# Altium project Kontrollerkort.PrjPcb
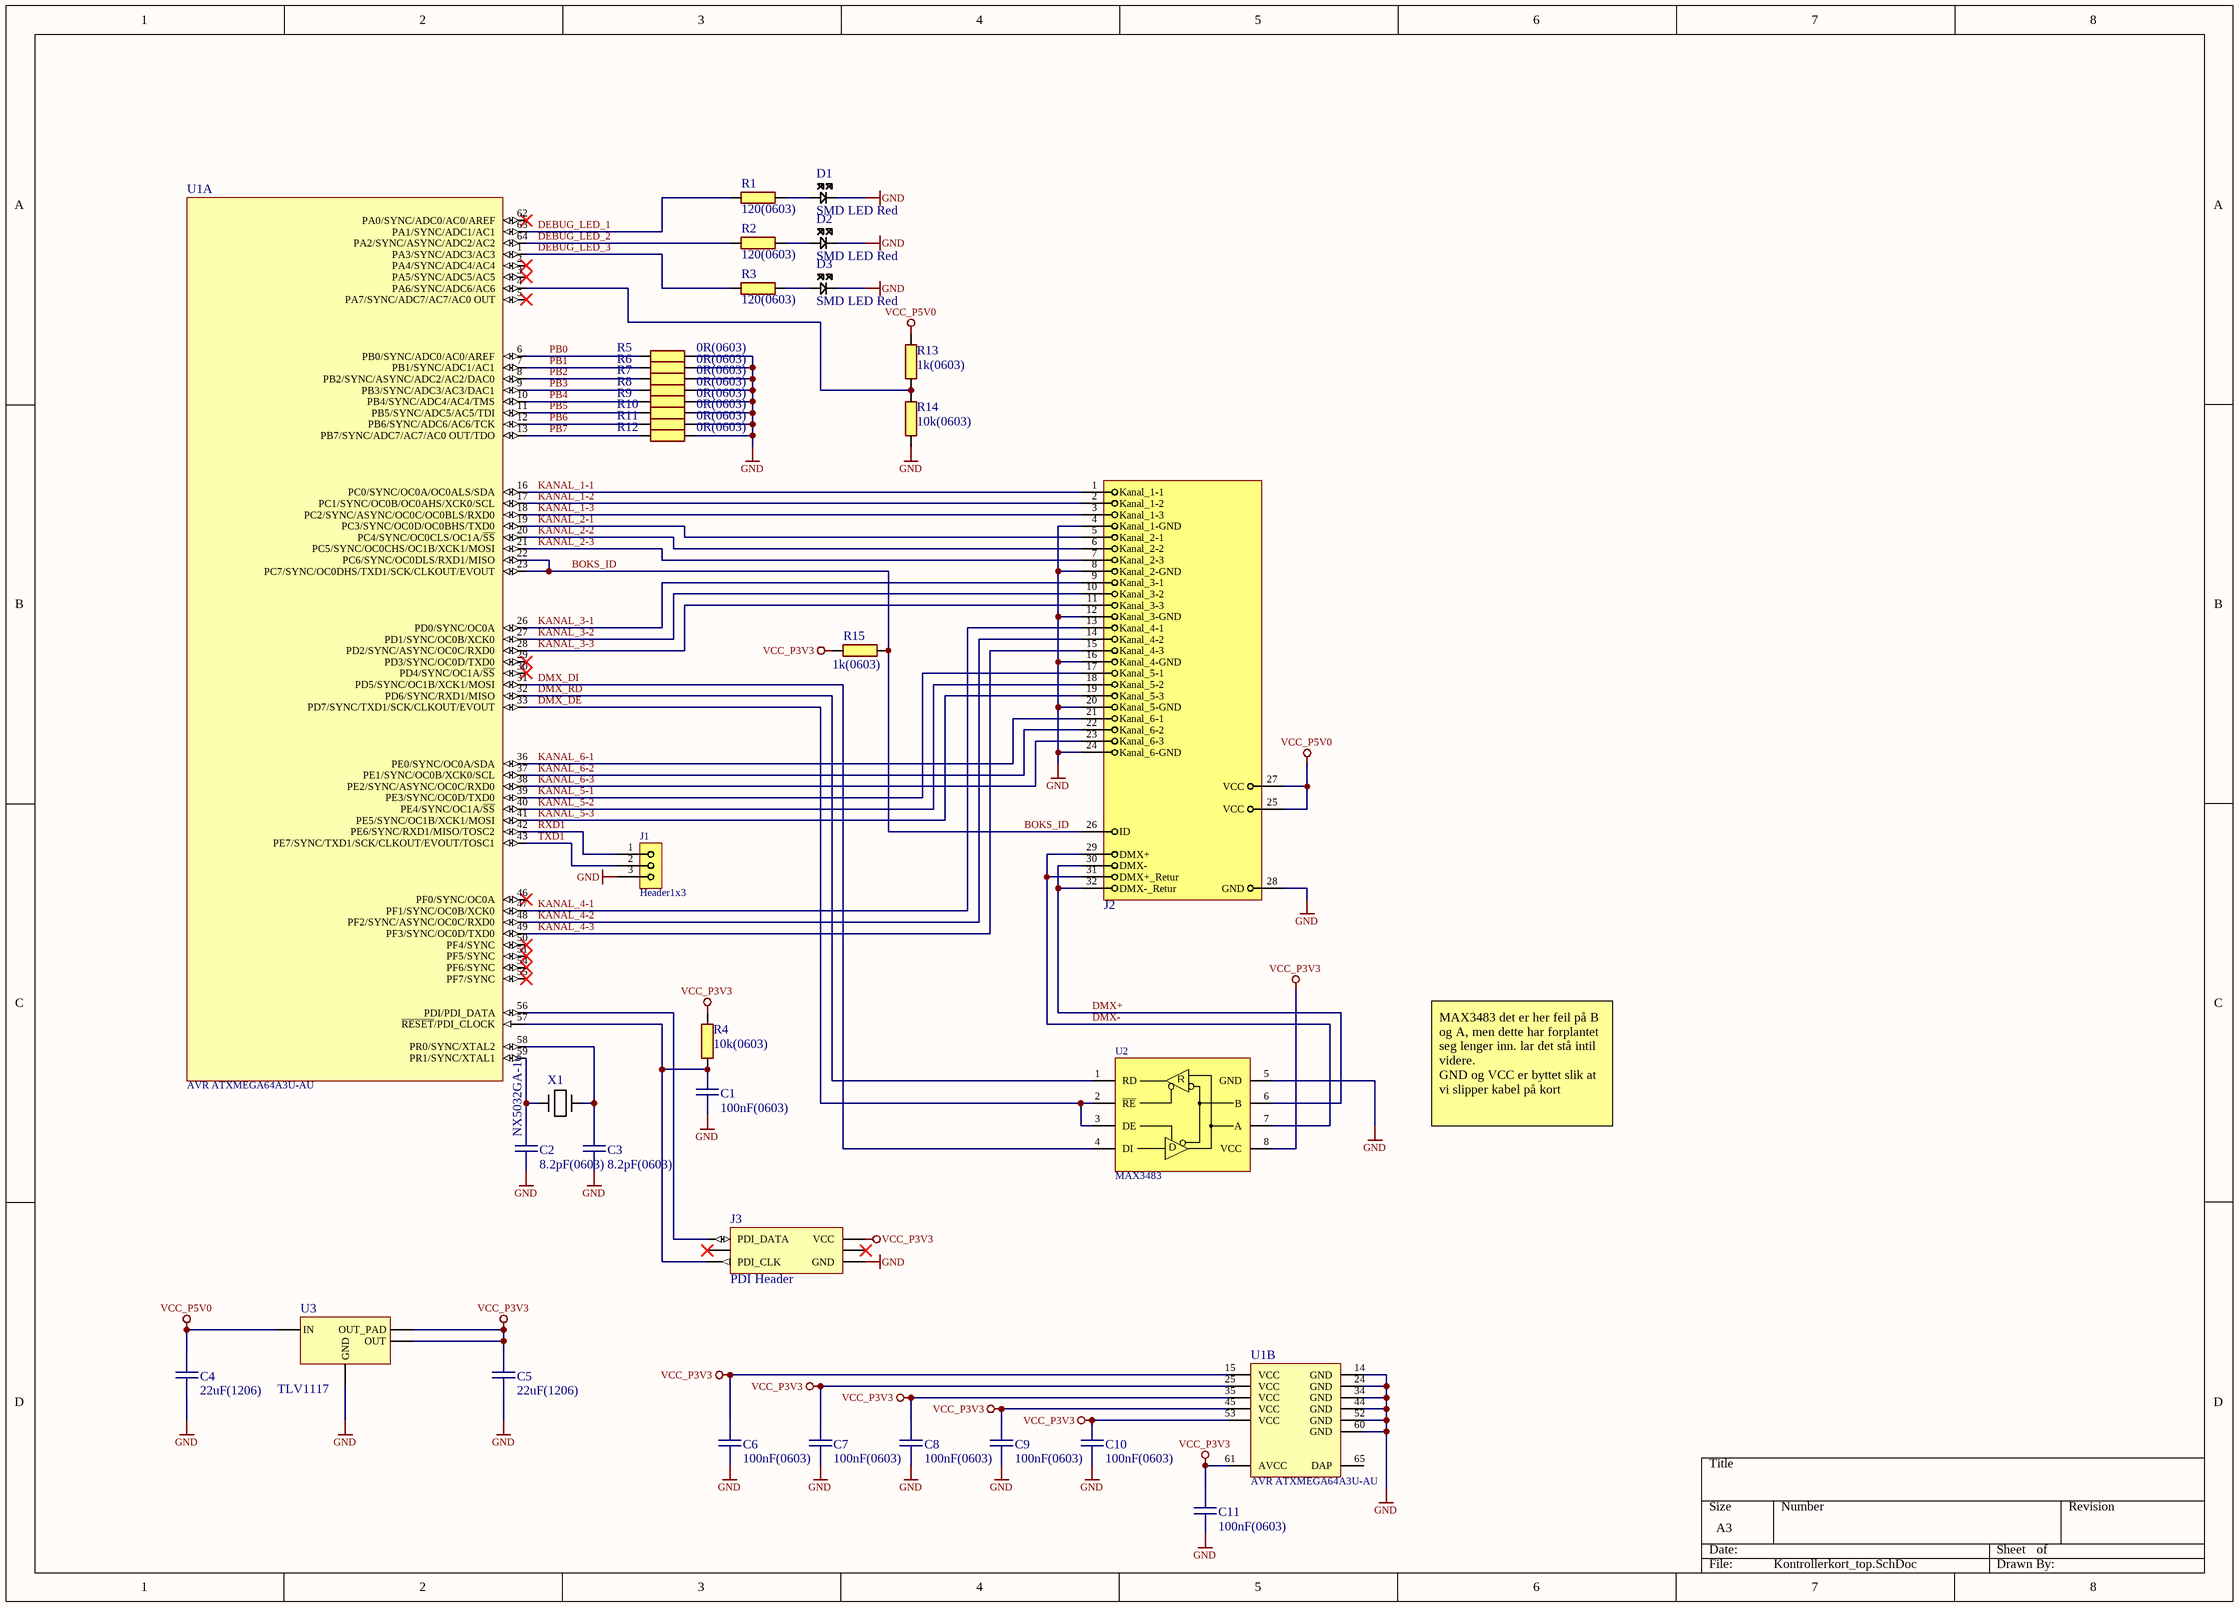
[diagram p0: Kontrollerkort_top.SchDoc]
1 sheet, 36 parts. Net scope: global (net labels, ports and power ports of the same name join across sheets).
Board file: Kontrollerkort.PcbDoc

## Sheet Kontrollerkort_top.SchDoc
size A3

### Parts
C1  100nF(0603)  [CAPC0603(1608)55_N]
C2  8.2pF(0603)  [CAPC0603(1608)55_N]
C3  8.2pF(0603)  [CAPC0603(1608)55_N]
C4  22uF(1206)  [CAPC1206(3216)170_N]
C5  22uF(1206)  [CAPC1206(3216)170_N]
C6  100nF(0603)  [CAPC0603(1608)55_N]
C7  100nF(0603)  [CAPC0603(1608)55_N]
C8  100nF(0603)  [CAPC0603(1608)55_N]
C9  100nF(0603)  [CAPC0603(1608)55_N]
C10  100nF(0603)  [CAPC0603(1608)55_N]
C11  100nF(0603)  [CAPC0603(1608)55_N]
D1  SMD LED Red  [I_LEDC0603(1608)_N]
D2  SMD LED Red  [I_LEDC0603(1608)_N]
D3  SMD LED Red  [I_LEDC0603(1608)_N]
J1  Header1x3  [HDRV3W64P254_1X3_762X254X900B]
J2  Lysreklameparalellbusskontakt2015  [HDRRA32W64P254_2X16_4064X1260X600B]  (value not drawn)
J3  PDI Header  [HEADER_3x2]
R1  120(0603)  [RESC0603(1608)_N]
R2  120(0603)  [RESC0603(1608)_N]
R3  120(0603)  [RESC0603(1608)_N]
R4  10k(0603)  [RESC0603(1608)_N]
R5  0R(0603)  [RESC0603(1608)_N]
R6  0R(0603)  [RESC0603(1608)_N]
R7  0R(0603)  [RESC0603(1608)_N]
R8  0R(0603)  [RESC0603(1608)_N]
R9  0R(0603)  [RESC0603(1608)_N]
R10  0R(0603)  [RESC0603(1608)_N]
R11  0R(0603)  [RESC0603(1608)_N]
R12  0R(0603)  [RESC0603(1608)_N]
R13  1k(0603)  [RESC0603(1608)_N]
R14  10k(0603)  [RESC0603(1608)_N]
R15  1k(0603)  [RESC0603(1608)_N]
U1  AVR ATXMEGA64A3U-AU  [TQFP64]  (parts A,B of 2)
U2  MAX3483  [SOIC-8-WIDE]
U3  TLV1117  [SOT230P700X180-4N]
X1  NX5032GA-16  [CRYSTAL-ABM7]

### Nets
GND: C1.1 C2.1 C3.1 C4.1 C5.1 C6.1 C7.1 C8.1 C9.1 C10.1 C11.1 D1.2 D2.2 D3.2 J1.3 J2.4(Kanal_1-GND) J2.8(Kanal_2-GND) J2.12(Kanal_3-GND) J2.16(Kanal_4-GND) J2.20(Kanal_5-GND) J2.24(Kanal_6-GND) J2.28(GND) J3.6(GND) R5.2 R6.2 R7.2 R8.2 R9.2 R10.2 R11.2 R12.2 R14.1 U1.14(GND) U1.24(GND) U1.34(GND) U1.44(GND) U1.52(GND) U1.60(GND) U2.5(GND) U3.1(GND)
VCC_P3V3: C5.2 C6.2 C7.2 C8.2 C9.2 C10.2 C11.2 J3.2(VCC) R4.2 R15.2 U1.15(VCC) U1.25(VCC) U1.35(VCC) U1.45(VCC) U1.53(VCC) U1.61(AVCC) U2.8(VCC) U3.2(OUT_PAD) U3.4(OUT)
VCC_P5V0: C4.2 J2.25(VCC) J2.27(VCC) R13.2 U3.3(IN)
BOKS_ID: J2.26(ID) R15.1 U1.22(PC6/SYNC/OC0DLS/RXD1/MISO) U1.23(PC7/SYNC/OC0DHS/TXD1/SCK/CLKOUT/EVOUT)
DEBUG_LED_1: R1.1 U1.63(PA1/SYNC/ADC1/AC1)
DEBUG_LED_2: R2.1 U1.64(PA2/SYNC/ASYNC/ADC2/AC2)
DEBUG_LED_3: R3.1 U1.1(PA3/SYNC/ADC3/AC3)
DMX+: J2.30(DMX-) J2.32(DMX-_Retur) U2.6(B)
DMX-: J2.29(DMX+) J2.31(DMX+_Retur) U2.7(A)
DMX_DE: U1.33(PD7/SYNC/TXD1/SCK/CLKOUT/EVOUT) U2.2(~{RE}) U2.3(DE)
DMX_DI: U1.31(PD5/SYNC/OC1B/XCK1/MOSI) U2.4(DI)
DMX_RD: U1.32(PD6/SYNC/RXD1/MISO) U2.1(RD)
KANAL_1-1: J2.1(Kanal_1-1) U1.16(PC0/SYNC/OC0A/OC0ALS/SDA)
KANAL_1-2: J2.2(Kanal_1-2) U1.17(PC1/SYNC/OC0B/OC0AHS/XCK0/SCL)
KANAL_1-3: J2.3(Kanal_1-3) U1.18(PC2/SYNC/ASYNC/OC0C/OC0BLS/RXD0)
KANAL_2-1: J2.5(Kanal_2-1) U1.19(PC3/SYNC/OC0D/OC0BHS/TXD0)
KANAL_2-2: J2.6(Kanal_2-2) U1.20(PC4/SYNC/OC0CLS/OC1A/~{SS})
KANAL_2-3: J2.7(Kanal_2-3) U1.21(PC5/SYNC/OC0CHS/OC1B/XCK1/MOSI)
KANAL_3-1: J2.9(Kanal_3-1) U1.26(PD0/SYNC/OC0A)
KANAL_3-2: J2.10(Kanal_3-2) U1.27(PD1/SYNC/OC0B/XCK0)
KANAL_3-3: J2.11(Kanal_3-3) U1.28(PD2/SYNC/ASYNC/OC0C/RXD0)
KANAL_4-1: J2.13(Kanal_4-1) U1.47(PF1/SYNC/OC0B/XCK0)
KANAL_4-2: J2.14(Kanal_4-2) U1.48(PF2/SYNC/ASYNC/OC0C/RXD0)
KANAL_4-3: J2.15(Kanal_4-3) U1.49(PF3/SYNC/OC0D/TXD0)
KANAL_5-1: J2.17(Kanal_5-1) U1.39(PE3/SYNC/OC0D/TXD0)
KANAL_5-2: J2.18(Kanal_5-2) U1.40(PE4/SYNC/OC1A/~{SS})
KANAL_5-3: J2.19(Kanal_5-3) U1.41(PE5/SYNC/OC1B/XCK1/MOSI)
KANAL_6-1: J2.21(Kanal_6-1) U1.36(PE0/SYNC/OC0A/SDA)
KANAL_6-2: J2.22(Kanal_6-2) U1.37(PE1/SYNC/OC0B/XCK0/SCL)
KANAL_6-3: J2.23(Kanal_6-3) U1.38(PE2/SYNC/ASYNC/OC0C/RXD0)
PB0: R5.1 U1.6(PB0/SYNC/ADC0/AC0/AREF)
PB1: R6.1 U1.7(PB1/SYNC/ADC1/AC1)
PB2: R7.1 U1.8(PB2/SYNC/ASYNC/ADC2/AC2/DAC0)
PB3: R8.1 U1.9(PB3/SYNC/ADC3/AC3/DAC1)
PB4: R9.1 U1.10(PB4/SYNC/ADC4/AC4/TMS)
PB5: R10.1 U1.11(PB5/SYNC/ADC5/AC5/TDI)
PB6: R11.1 U1.12(PB6/SYNC/ADC6/AC6/TCK)
PB7: R12.1 U1.13(PB7/SYNC/ADC7/AC7/AC0_OUT/TDO)
RXD1: J1.1 U1.42(PE6/SYNC/RXD1/MISO/TOSC2)
TXD1: J1.2 U1.43(PE7/SYNC/TXD1/SCK/CLKOUT/EVOUT/TOSC1)
NetC1_2: C1.2 J3.5(PDI_CLK) R4.1 U1.57(~{RESET}/PDI_CLOCK)
NetC2_2: C2.2 U1.59(PR1/SYNC/XTAL1) X1.1
NetC3_2: C3.2 U1.58(PR0/SYNC/XTAL2) X1.2
NetD1_1: D1.1 R1.2
NetD2_1: D2.1 R2.2
NetD3_1: D3.1 R3.2
NetJ3_1: J3.1(PDI_DATA) U1.56(PDI/PDI_DATA)
NetR13_1: R13.1 R14.2 U1.4(PA6/SYNC/ADC6/AC6)

Not connected (* = marked no-connect by the designer): J3 3* 4*; U1 2(PA4/SYNC/ADC4/AC4)* 3(PA5/SYNC/ADC5/AC5)* 5(PA7/SYNC/ADC7/AC7/AC0_OUT)* 29(PD3/SYNC/OC0D/TXD0)* 30(PD4/SYNC/OC1A/~{SS})* 46(PF0/SYNC/OC0A)* 50(PF4/SYNC)* 51(PF5/SYNC)* 54(PF6/SYNC)* 55(PF7/SYNC)* 62(PA0/SYNC/ADC0/AC0/AREF)* 65(DAP)

### Notes on the sheet
- MAX3483 det er her feil på B og A, men dette har forplantet seg lenger inn. lar det stå intil videre.
  GND og VCC er byttet slik at vi slipper kabel på kort
- (in symbol MAX3483) R; D

### Library data of the parts
C1 C6-C11 = 100nF(0603): 100nF 0603 5% X7R 50V; pakke_opprettet_av: 815; pris: 1; nokkelord: Kondensator, Capacitor, CAP; pakketype: 93; id: 3028; navn: 100nF(0603); pakke_opprettet: 18.02.2015 14:18:13; symbol_opprettet_av: 815; symbol_opprettet: 14.11.2014 20:19:34
C2 C3 = 8.2pF(0603): 0603 5% NP0 50V; pakke_opprettet_av: 815; pris: 1; nokkelord: Kondensator, Capacitor, CAP; pakketype: 93; id: 3032; navn: 8.2pF(0603); pakke_opprettet: 18.02.2015 14:18:13; symbol_opprettet_av: 815; symbol_opprettet: 14.11.2014 20:19:34
C4 C5 = 22uF(1206): 1206 10% Tantalum 10V; pakke_opprettet_av: 815; leverandor_varenr: 1457420; pris: 3; nokkelord: Capacitor Cap Kondis; pakketype: 95; produsent: Kemet; leverandor: Farnell; id: 3049; navn: 22uF(1206); pakke_opprettet: 11.02.2015 13:21:22; symbol_opprettet_av: 815; symbol_opprettet: 14.11.2014 20:19:34
D1-D3 = SMD LED Red: SMD; rad: 0; rom: OV; lager_type: Fremlager; dybde: 2; hylle: 13; antall: 50; pakke_opprettet_av: 815; leverandor_varenr: 8554641; pris: 1; pakketype: 93; produsent: Avago; leverandor: Farnell; id: 2209; navn: SMD LED Red; kolonne: 0; pakke_opprettet: 06.07.2014 18:55:44; symbol_opprettet_av: 815; symbol_opprettet: 06.07.2014 18:59:47; nokkelord: SMD
J1 = Header 1x3: 2,54mm pitch; pakke_opprettet_av: 815; pris: 2; pakketype: 92; id: 2430; navn: Header 1x3; pakke_opprettet: 13.11.2014 12:31:03; symbol_opprettet_av: 815; symbol_opprettet: 13.11.2014 10:59:05
J3 = PDI-HEADER: PDI Xmega programming header; pakke_opprettet_av: 774; leverandor_varenr: Derp; pris: 3; pakketype: 92; produsent: OV; leverandor: Farnell; id: 2407; navn: PDI-HEADER; pakke_opprettet: 23.08.2014 13:37:50; symbol_opprettet_av: 774; symbol_opprettet: 23.08.2014 13:38:30; nokkelord: PDI Xmega programming
R1-R3 = 3050: 120R 0603 0.1W 1% Thick film resistor; id: 3050; pakke_opprettet_av: 815; symbol_opprettet_av: oystesm; pris: 0; pakketype: 93; pakke_opprettet: 08.07.2014 21:15:30; symbol_opprettet: 08.07.2014 21:16:33; navn: 120(0603); nokkelord: Resistor
R4 = 2444: 10k 0603 0.1W 1% Thick film resistor; id: 2444; rad: -1; rom: OV; lager_type: Fremlager; dybde: 72; hylle: 6; antall: 100; kolonne: 0; pakke_opprettet_av: 815; symbol_opprettet_av: oystesm; nokkelord: Resistor Motstand; pakketype: 93; pakke_opprettet: 08.07.2014 21:15:30; symbol_opprettet: 08.07.2014 21:16:33; navn: 10k(0603); pris: 0
R5-R12 = 3186: 0.1W 1% Thick film resistor; id: 3186; pakke_opprettet_av: 815; symbol_opprettet_av: oystesm; pris: 0; nokkelord: Resistor Motstand Jumper Lask; pakketype: 93; produsent: Multikomp; pakke_opprettet: 08.07.2014 21:15:30; symbol_opprettet: 08.07.2014 21:16:33; navn: 0R(0603)
R13 = 3029: 0603 0.1W 1% Thick film resistor; id: 3029; pakke_opprettet_av: 815; symbol_opprettet_av: oystesm; pris: 0; nokkelord: Resistor Motstand; pakketype: 93; leverandor_varenr: 2447272; produsent: Multikomp; leverandor: Farnell; pakke_opprettet: 08.07.2014 21:15:30; symbol_opprettet: 08.07.2014 21:16:33; navn: 1k(0603)
R14 = 2444: 10k 0603 0.1W 1% Thick film resistor; id: 2444; rad: -1; rom: OV; lager_type: Fremlager; dybde: 72; hylle: 6; antall: 100; kolonne: 0; pakke_opprettet_av: 815; symbol_opprettet_av: oystesm; nokkelord: Resistor Motstand; pakketype: 93; leverandor_varenr: 2447230; produsent: Multikomp; leverandor: Farnell; pakke_opprettet: 08.07.2014 21:15:30; symbol_opprettet: 08.07.2014 21:16:33; navn: 10k(0603); pris: 0
R15 = 3029: 0603 0.1W 1% Thick film resistor; id: 3029; pakke_opprettet_av: 815; symbol_opprettet_av: oystesm; pris: 0; nokkelord: Resistor Motstand; pakketype: 93; produsent: Multikomp; pakke_opprettet: 08.07.2014 21:15:30; symbol_opprettet: 08.07.2014 21:16:33; navn: 1k(0603)
U1 = AVR ATXMEGA64A3U-AU: Mikrokontroller; rad: 4; rom: OV; lager_type: Fremlager; dybde: 0; antall: 40; kolonne: 1; pakke_opprettet_av: 815; pakketype: 45; produsent: Atmel; id: 2105; navn: AVR ATXMEGA64A3U-AU; hylle: 0; pakke_opprettet: 13.07.2014 19:45:53; symbol_opprettet_av: 815; symbol_opprettet: 07.05.2015 23:14:48; pris: 0
U2 = MAX3483: 3.3V-Powered, 10Mbps and Slew-Rate-Limited True RS-485/RS-422 Transceivers; rad: 4; rom: OV; lager_type: Fremlager; dybde: 0; hylle: 2; antall: 40; pakke_opprettet_av: 815; pris: 22; nokkelord: RS485; pakketype: 53; produsent: Exar; id: 3048; leverandor_varenr: 1296640; leverandor: Farnell; navn: MAX3483; kolonne: 4; pakke_opprettet: 28.06.2014 18:39:37; symbol_opprettet_av: 815; symbol_opprettet: 07.05.2015 21:29:51
U3 = TLV1117: 3,3V Low dropout regulator; pakke_opprettet_av: 774; leverandor_varenr: 1494942; pris: 5; nokkelord: ldo; pakketype: 77; produsent: Texas Instruments; leverandor: Farnell; id: 2386; rad: 2; rom: OV; lager_type: Fremlager; dybde: 0; hylle: 9; antall: 10; navn: TLV1117; pakke_opprettet: 11.07.2014 22:00:23; symbol_opprettet_av: 774; symbol_opprettet: 11.07.2014 22:01:42; kolonne: 0
X1 = NX5032GA-16: Crystal 16 MHz; rad: 0; rom: OV; lager_type: Fremlager; dybde: 1; hylle: 2; antall: 42; kolonne: 3; pakke_opprettet_av: 774; leverandor_varenr: 644-1135-1-ND; pris: 5; nokkelord: xtal, oscillator; pakketype: 101; produsent: NDK; leverandor: DigiKey; id: 1594; navn: NX5032GA-16; pakke_opprettet: 23.08.2014 20:10:40; symbol_opprettet_av: 774; symbol_opprettet: 23.08.2014 20:23:20